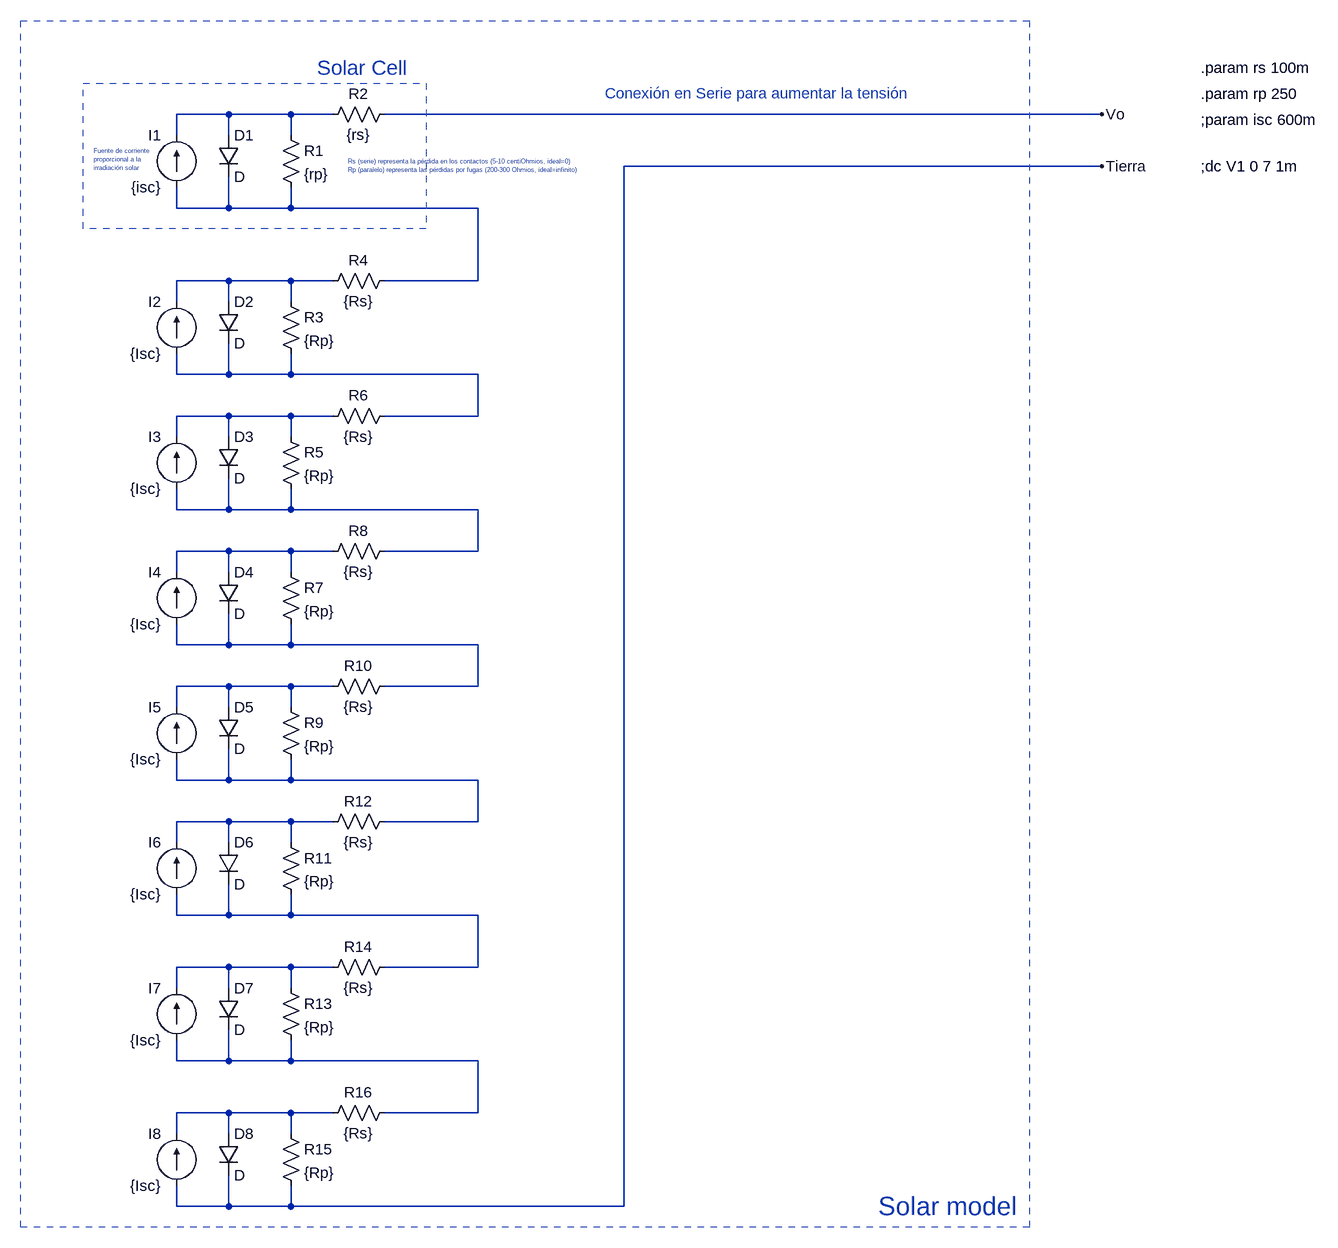
[diagram p0: schematic Solar_model.asc]
Solar_model.asc, the LTspice schematic file:
Version 4
SHEET 1 1732 1608
WIRE -192 -144 -272 -144
WIRE -96 -144 -192 -144
WIRE -32 -144 -96 -144
WIRE 1152 -144 48 -144
WIRE -272 -112 -272 -144
WIRE -192 -112 -192 -144
WIRE -96 -112 -96 -144
WIRE 1152 -64 416 -64
WIRE -272 0 -272 -32
WIRE -192 0 -192 -48
WIRE -192 0 -272 0
WIRE -96 0 -96 -32
WIRE -96 0 -192 0
WIRE 192 0 -96 0
WIRE -192 112 -272 112
WIRE -96 112 -192 112
WIRE -32 112 -96 112
WIRE 192 112 192 0
WIRE 192 112 48 112
WIRE -272 144 -272 112
WIRE -192 144 -192 112
WIRE -96 144 -96 112
WIRE -272 256 -272 224
WIRE -192 256 -192 208
WIRE -192 256 -272 256
WIRE -96 256 -96 224
WIRE -96 256 -192 256
WIRE 192 256 -96 256
WIRE -192 320 -272 320
WIRE -96 320 -192 320
WIRE -32 320 -96 320
WIRE 192 320 192 256
WIRE 192 320 48 320
WIRE -272 352 -272 320
WIRE -192 352 -192 320
WIRE -96 352 -96 320
WIRE -272 464 -272 432
WIRE -192 464 -192 416
WIRE -192 464 -272 464
WIRE -96 464 -96 432
WIRE -96 464 -192 464
WIRE 192 464 -96 464
WIRE -192 528 -272 528
WIRE -96 528 -192 528
WIRE -32 528 -96 528
WIRE 192 528 192 464
WIRE 192 528 48 528
WIRE -272 560 -272 528
WIRE -192 560 -192 528
WIRE -96 560 -96 528
WIRE -272 672 -272 640
WIRE -192 672 -192 624
WIRE -192 672 -272 672
WIRE -96 672 -96 640
WIRE -96 672 -192 672
WIRE 192 672 -96 672
WIRE -192 736 -272 736
WIRE -96 736 -192 736
WIRE -32 736 -96 736
WIRE 192 736 192 672
WIRE 192 736 48 736
WIRE -272 768 -272 736
WIRE -192 768 -192 736
WIRE -96 768 -96 736
WIRE -272 880 -272 848
WIRE -192 880 -192 832
WIRE -192 880 -272 880
WIRE -96 880 -96 848
WIRE -96 880 -192 880
WIRE 192 880 -96 880
WIRE -192 944 -272 944
WIRE -96 944 -192 944
WIRE -32 944 -96 944
WIRE 192 944 192 880
WIRE 192 944 48 944
WIRE -272 976 -272 944
WIRE -192 976 -192 944
WIRE -96 976 -96 944
WIRE -272 1088 -272 1056
WIRE -192 1088 -192 1040
WIRE -192 1088 -272 1088
WIRE -96 1088 -96 1056
WIRE -96 1088 -192 1088
WIRE 192 1088 -96 1088
WIRE -192 1168 -272 1168
WIRE -96 1168 -192 1168
WIRE -32 1168 -96 1168
WIRE 192 1168 192 1088
WIRE 192 1168 48 1168
WIRE -272 1200 -272 1168
WIRE -192 1200 -192 1168
WIRE -96 1200 -96 1168
WIRE -272 1312 -272 1280
WIRE -192 1312 -192 1264
WIRE -192 1312 -272 1312
WIRE -96 1312 -96 1280
WIRE -96 1312 -192 1312
WIRE 192 1312 -96 1312
WIRE -192 1392 -272 1392
WIRE -96 1392 -192 1392
WIRE -32 1392 -96 1392
WIRE 192 1392 192 1312
WIRE 192 1392 48 1392
WIRE -272 1424 -272 1392
WIRE -192 1424 -192 1392
WIRE -96 1424 -96 1392
WIRE -272 1536 -272 1504
WIRE -192 1536 -192 1488
WIRE -192 1536 -272 1536
WIRE -96 1536 -96 1504
WIRE -96 1536 -192 1536
WIRE 416 1536 416 -64
WIRE 416 1536 -96 1536
FLAG 1152 -144 Vo
FLAG 1152 -64 Tierra
SYMBOL current -272 -32 R180
WINDOW 0 24 80 Left 2
WINDOW 3 24 0 Left 2
WINDOW 123 0 0 Left 0
WINDOW 39 0 0 Left 0
SYMATTR InstName I1
SYMATTR Value {isc}
SYMBOL diode -208 -112 R0
SYMATTR InstName D1
SYMBOL res -112 -128 R0
SYMATTR InstName R1
SYMATTR Value {rp}
SYMBOL res 64 -160 R90
WINDOW 0 0 56 VBottom 2
WINDOW 3 32 56 VTop 2
SYMATTR InstName R2
SYMATTR Value {rs}
SYMBOL current -272 224 R180
WINDOW 0 24 80 Left 2
WINDOW 3 24 0 Left 2
WINDOW 123 0 0 Left 0
WINDOW 39 0 0 Left 0
SYMATTR InstName I2
SYMATTR Value {Isc}
SYMBOL diode -208 144 R0
SYMATTR InstName D2
SYMBOL res -112 128 R0
SYMATTR InstName R3
SYMATTR Value {Rp}
SYMBOL res 64 96 R90
WINDOW 0 0 56 VBottom 2
WINDOW 3 32 56 VTop 2
SYMATTR InstName R4
SYMATTR Value {Rs}
SYMBOL current -272 432 R180
WINDOW 0 24 80 Left 2
WINDOW 3 24 0 Left 2
WINDOW 123 0 0 Left 0
WINDOW 39 0 0 Left 0
SYMATTR InstName I3
SYMATTR Value {Isc}
SYMBOL diode -208 352 R0
SYMATTR InstName D3
SYMBOL res -112 336 R0
SYMATTR InstName R5
SYMATTR Value {Rp}
SYMBOL res 64 304 R90
WINDOW 0 0 56 VBottom 2
WINDOW 3 32 56 VTop 2
SYMATTR InstName R6
SYMATTR Value {Rs}
SYMBOL current -272 640 R180
WINDOW 0 24 80 Left 2
WINDOW 3 24 0 Left 2
WINDOW 123 0 0 Left 0
WINDOW 39 0 0 Left 0
SYMATTR InstName I4
SYMATTR Value {Isc}
SYMBOL diode -208 560 R0
SYMATTR InstName D4
SYMBOL res -112 544 R0
SYMATTR InstName R7
SYMATTR Value {Rp}
SYMBOL res 64 512 R90
WINDOW 0 0 56 VBottom 2
WINDOW 3 32 56 VTop 2
SYMATTR InstName R8
SYMATTR Value {Rs}
SYMBOL current -272 848 R180
WINDOW 0 24 80 Left 2
WINDOW 3 24 0 Left 2
WINDOW 123 0 0 Left 0
WINDOW 39 0 0 Left 0
SYMATTR InstName I5
SYMATTR Value {Isc}
SYMBOL diode -208 768 R0
SYMATTR InstName D5
SYMBOL res -112 752 R0
SYMATTR InstName R9
SYMATTR Value {Rp}
SYMBOL res 64 720 R90
WINDOW 0 0 56 VBottom 2
WINDOW 3 32 56 VTop 2
SYMATTR InstName R10
SYMATTR Value {Rs}
SYMBOL current -272 1056 R180
WINDOW 0 24 80 Left 2
WINDOW 3 24 0 Left 2
WINDOW 123 0 0 Left 0
WINDOW 39 0 0 Left 0
SYMATTR InstName I6
SYMATTR Value {Isc}
SYMBOL diode -208 976 R0
SYMATTR InstName D6
SYMBOL res -112 960 R0
SYMATTR InstName R11
SYMATTR Value {Rp}
SYMBOL res 64 928 R90
WINDOW 0 0 56 VBottom 2
WINDOW 3 32 56 VTop 2
SYMATTR InstName R12
SYMATTR Value {Rs}
SYMBOL current -272 1280 R180
WINDOW 0 24 80 Left 2
WINDOW 3 24 0 Left 2
WINDOW 123 0 0 Left 0
WINDOW 39 0 0 Left 0
SYMATTR InstName I7
SYMATTR Value {Isc}
SYMBOL diode -208 1200 R0
SYMATTR InstName D7
SYMBOL res -112 1184 R0
SYMATTR InstName R13
SYMATTR Value {Rp}
SYMBOL res 64 1152 R90
WINDOW 0 0 56 VBottom 2
WINDOW 3 32 56 VTop 2
SYMATTR InstName R14
SYMATTR Value {Rs}
SYMBOL current -272 1504 R180
WINDOW 0 24 80 Left 2
WINDOW 3 24 0 Left 2
WINDOW 123 0 0 Left 0
WINDOW 39 0 0 Left 0
SYMATTR InstName I8
SYMATTR Value {Isc}
SYMBOL diode -208 1424 R0
SYMATTR InstName D8
SYMBOL res -112 1408 R0
SYMATTR InstName R15
SYMATTR Value {Rp}
SYMBOL res 64 1376 R90
WINDOW 0 0 56 VBottom 2
WINDOW 3 32 56 VTop 2
SYMATTR InstName R16
SYMATTR Value {Rs}
TEXT 1304 -216 Left 2 !.param rs 100m
TEXT 1304 -176 Left 2 !.param rp 250
TEXT 1304 -136 Left 2 !;param isc 600m
TEXT -56 -216 Left 3 ;Solar Cell
TEXT -8 -72 Left 0 ;Rs (serie) representa la pérdida en los contactos (5-10 centiOhmios, ideal=0)\nRp (paralelo) representa las pérdidas por fugas (200-300 Ohmios, ideal=infinito)
TEXT -400 -88 Left 0 ;Fuente de corriente\nproporcional a la \nirradiación solar
TEXT 808 1536 Left 4 ;Solar model
TEXT 1304 -64 Left 2 !;dc V1 0 7 1m
TEXT 624 -192 Top 2 ;Conexión en Serie para aumentar la tensión
RECTANGLE Normal 112 32 -416 -192 1
RECTANGLE Normal 1040 1568 -512 -288 2

The netlist it stands for:
* Solar_model.asc
I1 N002 N001 {isc}
D1 N001 N002 D
R1 N001 N002 {rp}
R2 Vo N001 {rs}
I2 N004 N003 {Isc}
D2 N003 N004 D
R3 N003 N004 {Rp}
R4 N002 N003 {Rs}
I3 N006 N005 {Isc}
D3 N005 N006 D
R5 N005 N006 {Rp}
R6 N004 N005 {Rs}
I4 N008 N007 {Isc}
D4 N007 N008 D
R7 N007 N008 {Rp}
R8 N006 N007 {Rs}
I5 N010 N009 {Isc}
D5 N009 N010 D
R9 N009 N010 {Rp}
R10 N008 N009 {Rs}
I6 N012 N011 {Isc}
D6 N011 N012 D
R11 N011 N012 {Rp}
R12 N010 N011 {Rs}
I7 N014 N013 {Isc}
D7 N013 N014 D
R13 N013 N014 {Rp}
R14 N012 N013 {Rs}
I8 Tierra N015 {Isc}
D8 N015 Tierra D
R15 N015 Tierra {Rp}
R16 N014 N015 {Rs}
.model D D
.lib standard.dio
.param rs 100m
.param rp 250
;param isc 600m
* Solar Cell
* Rs (serie) representa la pérdida en los contactos (5-10 centiOhmios, ideal=0)
* Rp (paralelo) representa las pérdidas por fugas (200-300 Ohmios, ideal=infinito)
* Fuente de corriente
* proporcional a la
* irradiación solar
* Solar model
;dc V1 0 7 1m
* Conexión en Serie para aumentar la tensión
.backanno
.end